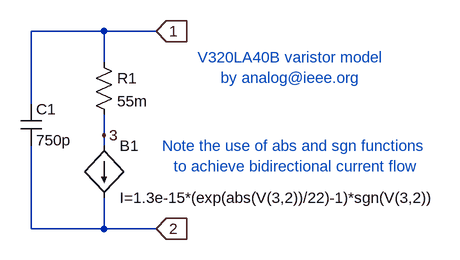
[diagram p0: schematic V320LA40B.asc]
V320LA40B.asc, the LTspice schematic file:
Version 4
SHEET 1 968 680
WIRE 16 192 16 320
WIRE 16 320 128 320
WIRE 128 320 128 272
WIRE 128 192 128 176
WIRE 128 64 128 16
WIRE 128 16 208 16
WIRE 16 16 16 128
WIRE 128 320 208 320
WIRE 128 16 16 16
WIRE 128 176 128 144
FLAG 208 16 1
IOPIN 208 16 In
FLAG 208 320 2
IOPIN 208 320 In
FLAG 128 176 3
SYMBOL bi 128 192 R0
SYMATTR InstName B1
SYMATTR Value I=1.3e-15*(exp(abs(V(3,2))/22)-1)*sgn(V(3,2))
SYMBOL res 112 48 R0
SYMATTR InstName R1
SYMATTR Value 55m
SYMBOL cap 0 128 R0
SYMATTR InstName C1
SYMATTR Value 750p
TEXT 416 72 Center 0 ;V320LA40B varistor model\nby analog@ieee.org
TEXT 424 208 Center 0 ;Note the use of abs and sgn functions \nto achieve bidirectional current flow

The netlist it stands for:
* V320LA40B.asc
B1 3 2 I=1.3e-15*(exp(abs(V(3,2))/22)-1)*sgn(V(3,2))
R1 1 3 55m
C1 1 2 750p
* V320LA40B varistor model
* by analog@ieee.org
* Note the use of abs and sgn functions
* to achieve bidirectional current flow
.backanno
.end